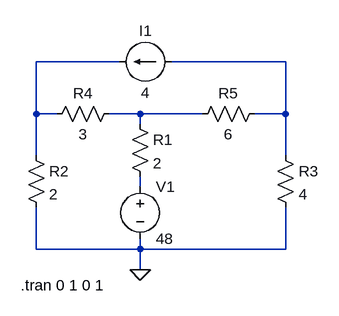
[diagram p0: schematic Circuit_7.asc]
Circuit_7.asc, the LTspice schematic file:
Version 4.1
SHEET 1 880 680
WIRE 176 16 48 16
WIRE 432 16 256 16
WIRE 48 96 48 16
WIRE 80 96 48 96
WIRE 208 96 160 96
WIRE 304 96 208 96
WIRE 432 96 432 16
WIRE 432 96 384 96
WIRE 208 112 208 96
WIRE 48 160 48 96
WIRE 432 160 432 96
WIRE 208 208 208 192
WIRE 48 304 48 240
WIRE 208 304 208 288
WIRE 208 304 48 304
WIRE 432 304 432 240
WIRE 432 304 208 304
WIRE 208 336 208 304
FLAG 208 336 0
SYMBOL voltage 208 192 R0
WINDOW 123 0 0 Left 0
WINDOW 39 0 0 Left 0
SYMATTR InstName V1
SYMATTR Value 48
SYMBOL res 192 96 R0
SYMATTR InstName R1
SYMATTR Value 2
SYMBOL res 32 144 R0
SYMATTR InstName R2
SYMATTR Value 2
SYMBOL res 416 144 R0
SYMATTR InstName R3
SYMATTR Value 4
SYMBOL res 176 80 R90
WINDOW 0 0 56 VBottom 2
WINDOW 3 32 56 VTop 2
SYMATTR InstName R4
SYMATTR Value 3
SYMBOL res 400 80 R90
WINDOW 0 0 56 VBottom 2
WINDOW 3 32 56 VTop 2
SYMATTR InstName R5
SYMATTR Value 6
SYMBOL current 256 16 R90
WINDOW 0 -32 40 VBottom 2
WINDOW 3 32 40 VTop 2
WINDOW 123 0 0 Left 0
WINDOW 39 0 0 Left 0
SYMATTR InstName I1
SYMATTR Value 4
TEXT 24 360 Left 2 !.tran 0 1 0 1

The netlist it stands for:
* Circuit_7.asc
V1 N004 0 48
R1 N003 N004 2
R2 N001 0 2
R3 N002 0 4
R4 N003 N001 3
R5 N002 N003 6
I1 N002 N001 4
.tran 0 1 0 1
.backanno
.end